# Altium project PCB_Project.PrjPcb (part 2 of 2)

## Sheet audio_in_dsp_radio.SchDoc
size A3
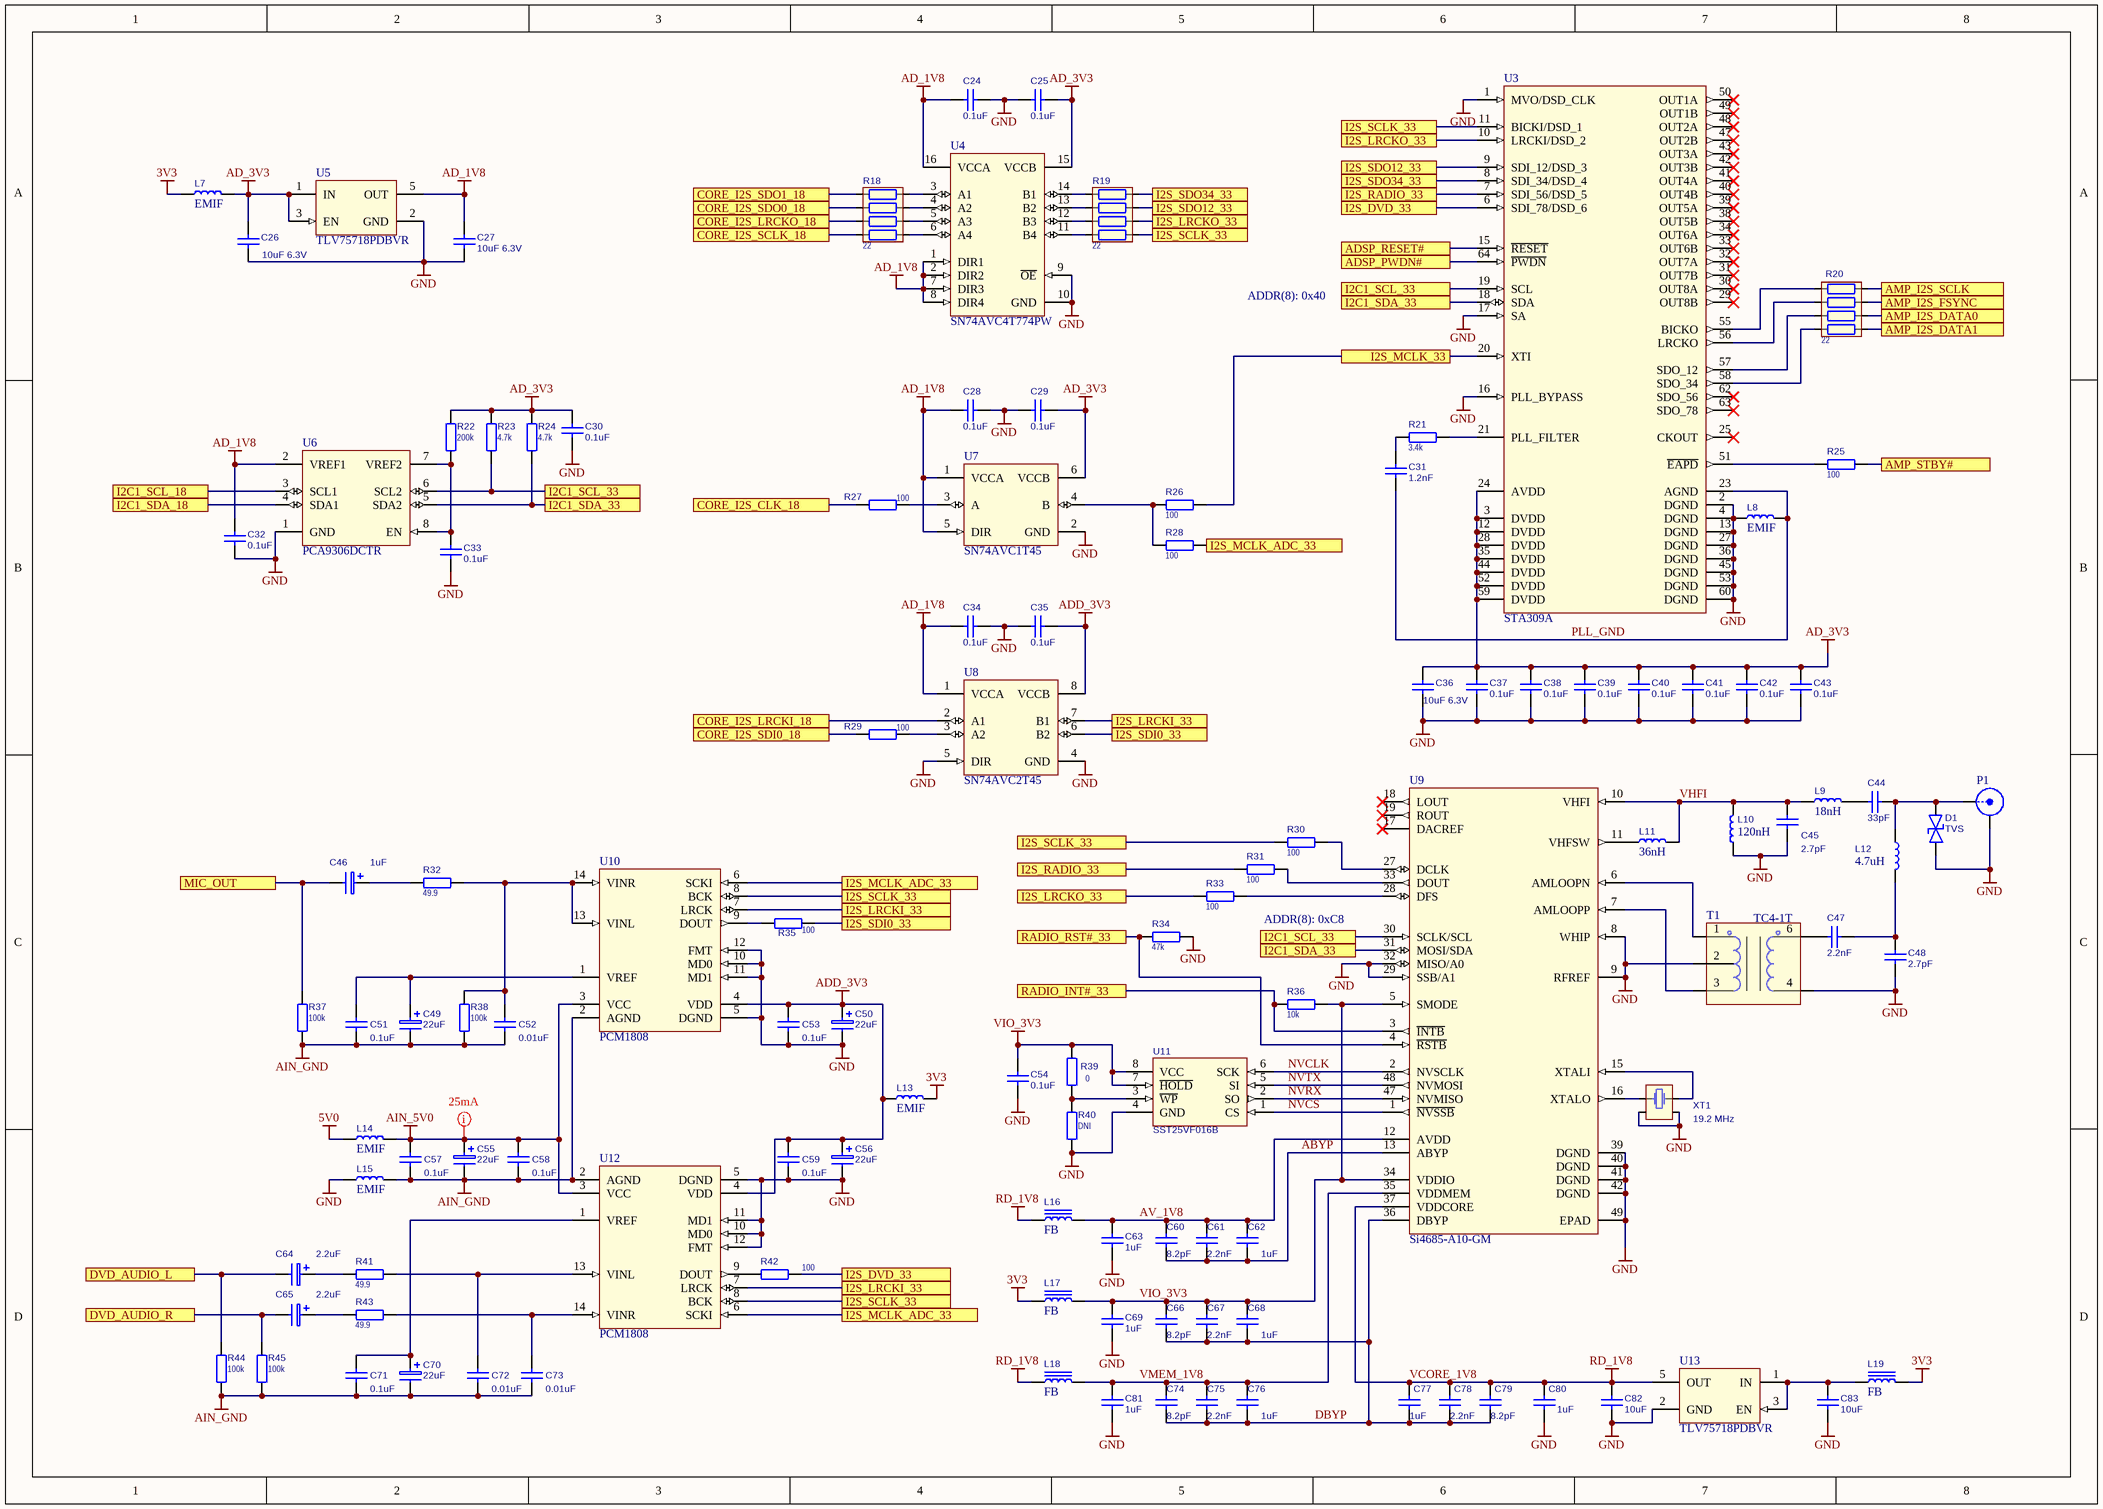
[diagram p5: audio_in_dsp_radio.SchDoc]

### Parts
C24  value 0.1uF  [C0603]  (hidden comment: C1608X7R1H104K080AA)
C25  value 0.1uF  [C0603]  (hidden comment: C1608X7R1H104K080AA)
C26  value 10uF 6.3V  [C0603]  (hidden comment: CC0603MRX5R5BB106)
C27  value 10uF 6.3V  [C0603]  (hidden comment: CC0603MRX5R5BB106)
C28  value 0.1uF  [C0603]  (hidden comment: C1608X7R1H104K080AA)
C29  value 0.1uF  [C0603]  (hidden comment: C1608X7R1H104K080AA)
C30  value 0.1uF  [C0603]  (hidden comment: C1608X7R1H104K080AA)
C31  value 1.2nF  [C0603]  (hidden comment: GRM1885C1H122JA01D)
C32  value 0.1uF  [C0603]  (hidden comment: C1608X7R1H104K080AA)
C33  value 0.1uF  [C0603]  (hidden comment: C1608X7R1H104K080AA)
C34  value 0.1uF  [C0603]  (hidden comment: C1608X7R1H104K080AA)
C35  value 0.1uF  [C0603]  (hidden comment: C1608X7R1H104K080AA)
C36  value 10uF 6.3V  [C0603]  (hidden comment: CC0603MRX5R5BB106)
C37  value 0.1uF  [C0603]  (hidden comment: C1608X7R1H104K080AA)
C38  value 0.1uF  [C0603]  (hidden comment: C1608X7R1H104K080AA)
C39  value 0.1uF  [C0603]  (hidden comment: C1608X7R1H104K080AA)
C40  value 0.1uF  [C0603]  (hidden comment: C1608X7R1H104K080AA)
C41  value 0.1uF  [C0603]  (hidden comment: C1608X7R1H104K080AA)
C42  value 0.1uF  [C0603]  (hidden comment: C1608X7R1H104K080AA)
C43  value 0.1uF  [C0603]  (hidden comment: C1608X7R1H104K080AA)
C44  value 33pF  [C0603]  (hidden comment: 06035A330JAT2A)
C45  value 2.7pF  [C0603]  (hidden comment: GCM1885C2A2R7BA16D)
C46  value 1uF  [TANTAL-A-1206]  (hidden comment: 293D105X9035A2TE3)
C47  value 2.2nF  [C0603]  (hidden comment: CL10B222KB8NNNC)
C48  value 2.7pF  [C0603]  (hidden comment: GCM1885C2A2R7BA16D)
C49  value 22uF  [TANTAL-A-1206]  (hidden comment: 293D226X9010A2TE3)
C50  value 22uF  [TANTAL-A-1206]  (hidden comment: 293D226X9010A2TE3)
C51  value 0.1uF  [C0603]  (hidden comment: CC0603KRX7R9BB104)
C52  value 0.01uF  [C0603]  (hidden comment: CL10B103KB8NNNC)
C53  value 0.1uF  [C0603]  (hidden comment: CC0603KRX7R9BB104)
C54  value 0.1uF  [C0603]  (hidden comment: CC0603KRX7R9BB104)
C55  value 22uF  [TANTAL-A-1206]  (hidden comment: 293D226X9010A2TE3)
C56  value 22uF  [TANTAL-A-1206]  (hidden comment: 293D226X9010A2TE3)
C57  value 0.1uF  [C0603]  (hidden comment: CC0603KRX7R9BB104)
C58  value 0.1uF  [C0603]  (hidden comment: CC0603KRX7R9BB104)
C59  value 0.1uF  [C0603]  (hidden comment: CC0603KRX7R9BB104)
C60  value 8.2pF  [C0603]  (hidden comment: CC0603CRNPO9BN8R2)
C61  value 2.2nF  [C0603]  (hidden comment: CL10B222KB8NNNC)
C62  value 1uF  [C0603]  (hidden comment: GRM188R61E105KA12D)
C63  value 1uF  [C0603]  (hidden comment: CC0603KRX7R9BB105)
C64  value 2.2uF  [TANTAL-A-1206]  (hidden comment: 293D225X9010A2TE3)
C65  value 2.2uF  [TANTAL-A-1206]  (hidden comment: 293D225X9010A2TE3)
C66  value 8.2pF  [C0603]  (hidden comment: CC0603CRNPO9BN8R2)
C67  value 2.2nF  [C0603]  (hidden comment: CL10B222KB8NNNC)
C68  value 1uF  [C0603]  (hidden comment: GRM188R61E105KA12D)
C69  value 1uF  [C0603]  (hidden comment: CC0603KRX7R9BB105)
C70  value 22uF  [TANTAL-A-1206]  (hidden comment: 293D226X9010A2TE3)
C71  value 0.1uF  [C0603]  (hidden comment: CC0603KRX7R9BB104)
C72  value 0.01uF  [C0603]  (hidden comment: CL10B103KB8NNNC)
C73  value 0.01uF  [C0603]  (hidden comment: CL10B103KB8NNNC)
C74  value 8.2pF  [C0603]  (hidden comment: CC0603CRNPO9BN8R2)
C75  value 2.2nF  [C0603]  (hidden comment: CL10B222KB8NNNC)
C76  value 1uF  [C0603]  (hidden comment: GRM188R61E105KA12D)
C77  value 1uF  [C0603]  (hidden comment: CC0603KRX7R9BB105)
C78  value 2.2nF  [C0603]  (hidden comment: CL10B222KB8NNNC)
C79  value 8.2pF  [C0603]  (hidden comment: CC0603CRNPO9BN8R2)
C80  value 1uF  [C0603]  (hidden comment: GRM188R61E105KA12D)
C81  value 1uF  [C0603]  (hidden comment: CC0603KRX7R9BB105)
C82  value 10uF  [C0603]  (hidden comment: CC0603MRX5R5BB106)
C83  value 10uF  [C0603]  (hidden comment: CC0603MRX5R5BB106)
D1  value TVS  [SOD-323]  (hidden comment: CDSOD323-T05LC)
L7  value EMIF  [IND0805]  (hidden comment: BLM21PG221SN1D)
L8  value EMIF  [IND0603]  (hidden comment: BLM18AG102SN1D)
L9  value 18nH  [IND0603]  (hidden comment: LQW18AN18NJ0ZD)
L10  value 120nH  [IND0603]  (hidden comment: LQW18ANR12J00D)
L11  value 36nH  [IND0603]  (hidden comment: LQW18AN36NG00D)
L12  value 4.7uH  [IND0603]  (hidden comment: CIL 10J 4R7)
L13  value EMIF  [IND0603]  (hidden comment: BLM18AG102SN1D)
L14  value EMIF  [IND0603]  (hidden comment: BLM18AG102SN1D)
L15  value EMIF  [IND0603]  (hidden comment: BLM18AG102SN1D)
L16  value FB  [IND0603]  (hidden comment: BLM18AG102SN1D)
L17  value FB  [IND0603]  (hidden comment: BLM18AG102SN1D)
L18  value FB  [IND0603]  (hidden comment: BLM18AG102SN1D)
L19  value FB  [IND0603]  (hidden comment: BLM18AG102SN1D)
P1  I-PEX  [SMA-RIGHT]  (value not drawn)
R18  value 22  [R0804X4]  (hidden comment: TC124-JR-0722RL)
R19  value 22  [R0804X4]  (hidden comment: TC124-JR-0722RL)
R20  value 22  [R0804X4]  (hidden comment: TC124-JR-0722RL)
R21  3.4k  [R0603]
R22  200k  [R0603]
R23  4.7k  [R0603]
R24  4.7k  [R0603]
R25  100  [R0603]
R26  100  [R0603]
R27  100  [R0603]
R28  100  [R0603]
R29  100  [R0603]
R30  100  [R0603]
R31  100  [R0603]
R32  49.9  [R0603]
R33  100  [R0603]
R34  47k  [R0603]
R35  100  [R0603]
R36  10k  [R0603]
R37  100k  [R0603]
R38  100k  [R0603]
R39  0  [R0603]
R40  DNI  [R0603]
R41  49.9  [R0603]
R42  100  [R0603]
R43  49.9  [R0603]
R44  100k  [R0603]
R45  100k  [R0603]
T1  TC4-1T  [AT224]
U3  STA309A  [LQFP64_N]
U4  SN74AVC4T774PW  [TSSOP-16]
U5  TLV75718PDBVR  [SOT-23-5]
U6  PCA9306DCTR  [SSOP-8]
U7  SN74AVC1T45  [SOT-23-6]
U8  SN74AVC2T45  [SSOP-8]
U9  value Si4685-A10-GM  [QFN-48-7X7]  (hidden comment: Si473x-GM)
U10  PCM1808  [TSSOP-14]
U11  SST25VF016B  [SOIC8WA]
U12  PCM1808  [TSSOP-14]
U13  TLV75718PDBVR  [SOT-23-5]
XT1  value 19.2 MHz  [NX3225]  (hidden comment: NX3225GA-19.2M)

### Ports
ADSP_PWDN#, ADSP_RESET#, AMP_I2S_DATA0, AMP_I2S_DATA1, AMP_I2S_FSYNC, AMP_I2S_SCLK, AMP_STBY#, CORE_I2S_CLK_18, CORE_I2S_LRCKI_18, CORE_I2S_LRCKO_18, CORE_I2S_SCLK_18, CORE_I2S_SDI0_18, CORE_I2S_SDO0_18, CORE_I2S_SDO1_18, DVD_AUDIO_L, DVD_AUDIO_R, I2C1_SCL_18, I2C1_SCL_33, I2C1_SDA_18, I2C1_SDA_33, I2S_DVD_33, I2S_LRCKI_33, I2S_LRCKO_33, I2S_MCLK_33, I2S_MCLK_ADC_33, I2S_RADIO_33, I2S_SCLK_33, I2S_SDI0_33, I2S_SDO12_33, I2S_SDO34_33, MIC_OUT, RADIO_INT#_33, RADIO_RST#_33

### Nets
3V3: L7.2 L13.1 L17.2 L19.1
5V0: L14.2
AD_1V8: C24.2 C27.1 C28.2 C32.2 C34.2 U4.1(DIR1) U4.2(DIR2) U4.7(DIR3) U4.8(DIR4) U4.16(VCCA) U5.5(OUT) U6.2(VREF1) U7.1(VCCA) U7.5(DIR) U8.1(VCCA)
AD_3V3: C25.1 C26.1 C29.1 C30.2 C36.1 C37.2 C38.2 C39.2 C40.2 C41.2 C42.2 C43.2 L7.1 R22.1 R23.1 R24.1 U3.3(DVDD) U3.12(DVDD) U3.24(AVDD) U3.28(DVDD) U3.35(DVDD) U3.44(DVDD) U3.52(DVDD) U3.59(DVDD) U4.15(VCCB) U5.1(IN) U5.3(EN) U7.6(VCCB)
ADD_3V3: C35.1 C50.1(+) C53.1 C56.1(+) C59.1 L13.2 U8.8(VCCB) U10.4(VDD) U12.4(VDD)
AIN_5V0: C55.1(+) C57.1 C58.1 L14.1 U10.3(VCC) U12.3(VCC)
AIN_GND: C49.2(-) C51.2 C52.2 C55.2(-) C57.2 C58.2 C70.2(-) C71.2 C72.2 C73.2 L15.1 R37.2 R38.2 R44.2 R45.2 U10.2(AGND) U12.2(AGND)
GND: C24.1 C25.2 C26.2 C27.2 C28.1 C29.2 C30.1 C32.1 C33.1 C34.1 C35.2 C36.2 C37.1 C38.1 C39.1 C40.1 C41.1 C42.1 C43.1 C45.1 C48.1 C50.2(-) C53.2 C54.2 C56.2(-) C59.2 C63.2 C69.2 C80.2 C81.2 C82.2 C83.2 D1.1 L8.2 L10.2 L15.2 P1.2(Y) R34.2 R40.1 T1.2 T1.4 U3.1(MVO/DSD_CLK) U3.2(DGND) U3.4(DGND) U3.13(DGND) U3.16(PLL_BYPASS) U3.17(SA) U3.27(DGND) U3.36(DGND) U3.45(DGND) U3.53(DGND) U3.60(DGND) U4.9(~{OE}) U4.10(GND) U5.2(GND) U6.1(GND) U7.2(GND) U8.4(GND) U8.5(DIR) U9.8(WHIP) U9.9(RFREF) U9.29(SSB/A1) U9.32(MISO/A0) U9.39(DGND) U9.40(DGND) U9.41(DGND) U9.42(DGND) U9.49(EPAD) U10.5(DGND) U10.10(MD0) U10.11(MD1) U10.12(FMT) U11.4(GND) U12.5(DGND) U12.10(MD0) U12.11(MD1) U12.12(FMT) U13.2(GND) XT1.2(GND) XT1.4(GND)
VCORE_1V8: C77.1 C78.1 C79.1 C80.1 C82.1 L16.2 L18.2 U9.37(VDDCORE) U13.5(OUT)  [also labelled RD_1V8]
VIO_3V3: C54.1 C66.1 C67.1 C68.1 C69.1 L17.1 R36.2 R39.2 U9.5(SMODE) U9.34(VDDIO) U11.7(~{HOLD}) U11.8(VCC)
ABYP: C60.2 C61.2 C62.2 U9.13(ABYP)
ADSP_PWDN#: U3.64(~{PWDN}) ; port ADSP_PWDN#
ADSP_RESET#: U3.15(~{RESET}) ; port ADSP_RESET#
AMP_I2S_DATA0: R20.5 ; port AMP_I2S_DATA0
AMP_I2S_DATA1: R20.7 ; port AMP_I2S_DATA1
AMP_I2S_FSYNC: R20.3 ; port AMP_I2S_FSYNC
AMP_I2S_SCLK: R20.1 ; port AMP_I2S_SCLK
AMP_STBY#: R25.2 ; port AMP_STBY#
AV_1V8: C60.1 C61.1 C62.1 C63.1 L16.1 U9.12(AVDD)
CORE_I2S_CLK_18: R27.1 ; port CORE_I2S_CLK_18
CORE_I2S_LRCKI_18: U8.2(A1) ; port CORE_I2S_LRCKI_18
CORE_I2S_LRCKO_18: R18.4 ; port CORE_I2S_LRCKO_18
CORE_I2S_SCLK_18: R18.2 ; port CORE_I2S_SCLK_18
CORE_I2S_SDI0_18: R29.1 ; port CORE_I2S_SDI0_18
CORE_I2S_SDO0_18: R18.6 ; port CORE_I2S_SDO0_18
CORE_I2S_SDO1_18: R18.8 ; port CORE_I2S_SDO1_18
DBYP: C66.2 C67.2 C68.2 C74.2 C75.2 C76.2 C77.2 C78.2 C79.2 U9.36(DBYP)
DVD_AUDIO_L: C64.2(-) R44.1 ; port DVD_AUDIO_L
DVD_AUDIO_R: C65.2(-) R45.1 ; port DVD_AUDIO_R
I2C1_SCL_18: U6.3(SCL1) ; port I2C1_SCL_18
I2C1_SCL_33: R23.2 U3.19(SCL) U6.6(SCL2) U9.30(SCLK/SCL) ; port I2C1_SCL_33
I2C1_SDA_18: U6.4(SDA1) ; port I2C1_SDA_18
I2C1_SDA_33: R24.2 U3.18(SDA) U6.5(SDA2) U9.31(MOSI/SDA) ; port I2C1_SDA_33
I2S_DVD_33: R42.2 U3.6(SDI_78/DSD_6) ; port I2S_DVD_33
I2S_LRCKI_33: U8.7(B1) U10.7(LRCK) U12.7(LRCK) ; port I2S_LRCKI_33
I2S_LRCKO_33: R19.3 R33.1 U3.10(LRCKI/DSD_2) ; port I2S_LRCKO_33
I2S_MCLK_33: R26.2 U3.20(XTI) ; port I2S_MCLK_33
I2S_MCLK_ADC_33: R28.2 U10.6(SCKI) U12.6(SCKI) ; port I2S_MCLK_ADC_33
I2S_RADIO_33: R31.1 U3.7(SDI_56/DSD_5) ; port I2S_RADIO_33
I2S_SCLK_33: R19.1 R30.1 U3.11(BICKI/DSD_1) U10.8(BCK) U12.8(BCK) ; port I2S_SCLK_33
I2S_SDI0_33: R35.2 U8.6(B2) ; port I2S_SDI0_33
I2S_SDO12_33: R19.5 U3.9(SDI_12/DSD_3) ; port I2S_SDO12_33
I2S_SDO34_33: R19.7 U3.8(SDI_34/DSD_4) ; port I2S_SDO34_33
MIC_OUT: C46.2(-) R37.1 ; port MIC_OUT
NVCLK: U9.2(NVSCLK) U11.6(SCK)
NVCS: U9.1(~{NVSSB}) U11.1(CS)
NVRX: U9.47(NVMISO) U11.2(SO)
NVTX: U9.48(NVMOSI) U11.5(SI)
PLL_GND: C31.2 L8.1 U3.23(AGND)
RADIO_INT#_33: R36.1 U9.3(~{INTB}) ; port RADIO_INT#_33
RADIO_RST#_33: R34.1 U9.4(~{RSTB}) ; port RADIO_RST#_33
VHFI: C45.2 L9.2 L10.1 L11.1 U9.10(VHFI)
VMEM_1V8: C74.1 C75.1 C76.1 C81.1 L18.1 U9.35(VDDMEM)
NetC31_1: C31.1 R21.2
NetC33_2: C33.2 R22.2 U6.7(VREF2) U6.8(EN)
NetC44_1: C44.1 L9.1
NetC44_2: C44.2 D1.2 L12.2 P1.1(X)
NetC46_1: C46.1(+) R32.1
NetC47_1: C47.1 T1.6
NetC47_2: C47.2 C48.2 L12.1
NetC49_1: C49.1(+) C51.1 U10.1(VREF)
NetC52_1: C52.1 R32.2 R38.1 U10.13(VINL) U10.14(VINR)
NetC64_1: C64.1(+) R41.1
NetC65_1: C65.1(+) R43.1
NetC70_1: C70.1(+) C71.1 U12.1(VREF)
NetC72_1: C72.1 R41.2 U12.13(VINL)
NetC73_1: C73.1 R43.2 U12.14(VINR)
NetC83_1: C83.1 L19.2 U13.1(IN) U13.3(EN)
NetL11_2: L11.2 U9.11(VHFSW)
NetR18_1: R18.1 U4.6(A4)
NetR18_3: R18.3 U4.5(A3)
NetR18_5: R18.5 U4.4(A2)
NetR18_7: R18.7 U4.3(A1)
NetR19_2: R19.2 U4.11(B4)
NetR19_4: R19.4 U4.12(B3)
NetR19_6: R19.6 U4.13(B2)
NetR19_8: R19.8 U4.14(B1)
NetR20_2: R20.2 U3.55(BICKO)
NetR20_4: R20.4 U3.56(LRCKO)
NetR20_6: R20.6 U3.57(SDO_12)
NetR20_8: R20.8 U3.58(SDO_34)
NetR21_1: R21.1 U3.21(PLL_FILTER)
NetR25_1: R25.1 U3.51(~{EAPD})
NetR26_1: R26.1 R28.1 U7.4(B)
NetR27_2: R27.2 U7.3(A)
NetR29_2: R29.2 U8.3(A2)
NetR30_2: R30.2 U9.27(DCLK)
NetR31_2: R31.2 U9.33(DOUT)
NetR33_2: R33.2 U9.28(DFS)
NetR35_1: R35.1 U10.9(DOUT)
NetR39_1: R39.1 R40.2 U11.3(~{WP})
NetR42_1: R42.1 U12.9(DOUT)
NetT1_1: T1.1 U9.6(AMLOOPN)
NetT1_3: T1.3 U9.7(AMLOOPP)
NetU9_15: U9.15(XTALI) XT1.1
NetU9_16: U9.16(XTALO) XT1.3

Not connected (* = marked no-connect by the designer): U3 25(CKOUT)* 29(OUT8B)* 30(OUT8A)* 31(OUT7B)* 32(OUT7A)* 33(OUT6B)* 34(OUT6A)* 38(OUT5B)* 39(OUT5A)* 40(OUT4B)* 41(OUT4A)* 42(OUT3B)* 43(OUT3A)* 47(OUT2B)* 48(OUT2A)* 49(OUT1B)* 50(OUT1A)* 62(SDO_56)* 63(SDO_78)*; U9 17(DACREF)* 18(LOUT)* 19(ROUT)*

### Layout directives
mark named 25mA: AIN_5V0

### Notes on the sheet
- ADDR(8): 0x40
- ADDR(8): 0xC8

### Library data of the parts
C24-C45 C47 C48 C51-C54 C57-C63 C66-C69 C71-C83 = CAP_NPOL
C46 C49 C50 C55 C56 C64 C65 C70 = CAP_POL
D1 = TVS_BIDIR: TVS Diodes
L7-L15 = IND_WO_IRON
L16-L19 = IND_W_IRON
P1 = BNC: LatestRevisionDate: 17-Jul-2002; LatestRevisionNote: Re-released for DXP Platform.; Publisher: Altium Limited
R18-R20 = ARRAY
R21-R45 = RESISTOR: RES
  R21: Value: 3.4k
  R22: Value: 200k
  R23 R24: Value: 4.7k
  R25-R31 R33 R35 R42: Value: 100
  R32 R41 R43: Value: 49.9
  R34: Value: 47k
  R36: Value: 10k
  R37 R38 R44 R45: Value: 100k
  R39: Value: 0
  R40: Value: DNI
T1 = TC4-1T: RF WIDEBAND; value: TC4-1T
U3 = STA309A: Multi-channel digital audio processor with DDX®; Value: STA309A
U4 = SN74AVC4T774PW: 4-Bit Dual-Supply Bus Transceiver With Configurable Voltage-Level Shifting and 3-State Outputs; value: SN74AVC4T774
U5 = TLV733P: Capacitor-Free, 300-mA, Low-Dropout Regulator with Foldback Current Limit for Portable Devices; value: TLV733P
U6 = PCA9306: PCA9306 Dual Bidirectional I2C Bus and SMBus Voltage-Level Translator; value: PCA9306DCTR
U7 = SN74AVC1T45: SN74AVC4T245 Dual-Bit Bus Transceiver with Configurable Voltage Translation and 3-State Outputs; value: SN74AVC1T45
U8 = SN74AVC2T45: SN74AVC4T245 Dual-Bit Bus Transceiver with Configurable Voltage Translation and 3-State Outputs; value: SN74AVC2T45
U9 = Si468x-GM: BROADCAST AM/AMHD-FM/FMHD-DAB/DAB+ RADIO RECEIVER
U10 U12 = PCM1808: PCM1808 Single-Ended, Analog-Input 24-Bit, 96-kHz Stereo ADC; value: PCM1808
U11 = AT25DF161: AT25DF161-SH-T; Value: SST25VF016B
U13 = TLV733P: Capacitor-Free, 1A, Low-Dropout Regulator with Foldback Current Limit for Portable Devices; value: TLV75718PDBVR
XT1 = XTAL4: Crystal rezonator 4 pins

## Sheet power_amp.SchDoc
size A4
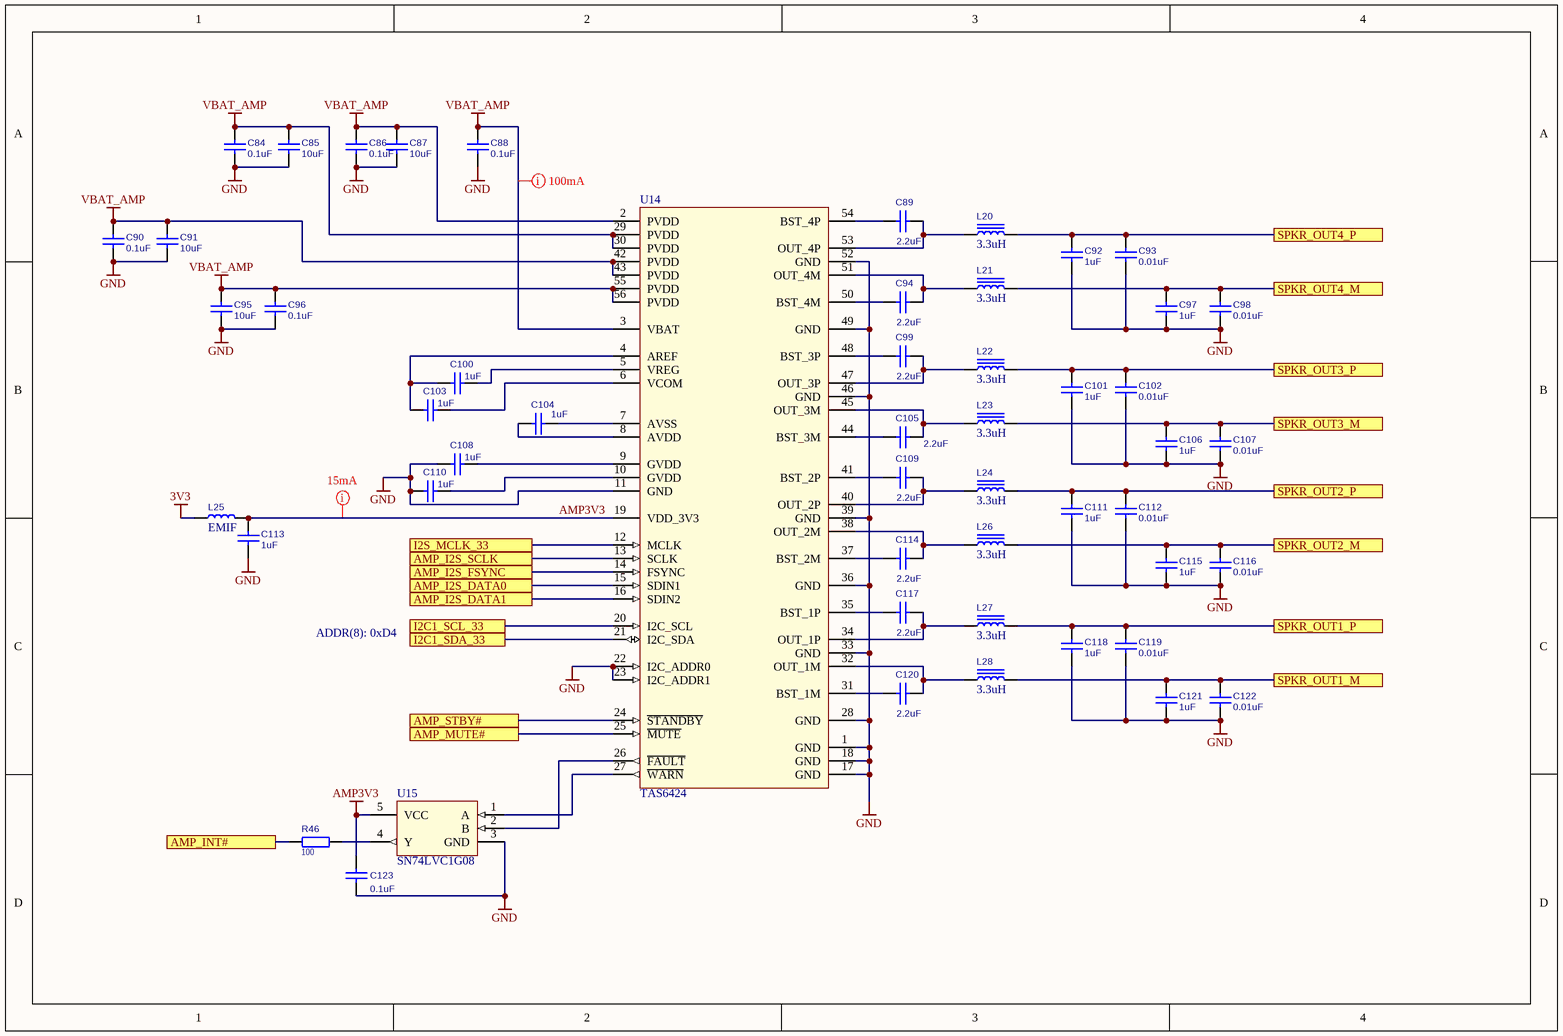
[diagram p6: power_amp.SchDoc]

### Parts
C84  value 0.1uF  [C0603]  (hidden comment: C1608X7R1H104K080AA)
C85  value 10uF  [C0805]  (hidden comment: GRM21BR61E106KA73L)
C86  value 0.1uF  [C0603]  (hidden comment: C1608X7R1H104K080AA)
C87  value 10uF  [C0805]  (hidden comment: GRM21BR61E106KA73L)
C88  value 0.1uF  [C0603]  (hidden comment: C1608X7R1H104K080AA)
C89  value 2.2uF  [C0603]  (hidden comment: GRM188R61H225KE11D)
C90  value 0.1uF  [C0603]  (hidden comment: C1608X7R1H104K080AA)
C91  value 10uF  [C0805]  (hidden comment: GRM21BR61E106KA73L)
C92  value 1uF  [C0603]  (hidden comment: CC0603KRX7R9BB105)
C93  value 0.01uF  [C0603]  (hidden comment: CL10B103KB8NNNC)
C94  value 2.2uF  [C0603]  (hidden comment: GRM188R61H225KE11D)
C95  value 10uF  [C0805]  (hidden comment: GRM21BR61E106KA73L)
C96  value 0.1uF  [C0603]  (hidden comment: C1608X7R1H104K080AA)
C97  value 1uF  [C0603]  (hidden comment: CC0603KRX7R9BB105)
C98  value 0.01uF  [C0603]  (hidden comment: CL10B103KB8NNNC)
C99  value 2.2uF  [C0603]  (hidden comment: GRM188R61H225KE11D)
C100  value 1uF  [C0603]  (hidden comment: CC0603KRX7R9BB105)
C101  value 1uF  [C0603]  (hidden comment: CC0603KRX7R9BB105)
C102  value 0.01uF  [C0603]  (hidden comment: CL10B103KB8NNNC)
C103  value 1uF  [C0603]  (hidden comment: CC0603KRX7R9BB105)
C104  value 1uF  [C0603]  (hidden comment: CC0603KRX7R9BB105)
C105  value 2.2uF  [C0603]  (hidden comment: GRM188R61H225KE11D)
C106  value 1uF  [C0603]  (hidden comment: CC0603KRX7R9BB105)
C107  value 0.01uF  [C0603]  (hidden comment: CL10B103KB8NNNC)
C108  value 1uF  [C0603]  (hidden comment: CC0603KRX7R9BB105)
C109  value 2.2uF  [C0603]  (hidden comment: GRM188R61H225KE11D)
C110  value 1uF  [C0603]  (hidden comment: CC0603KRX7R9BB105)
C111  value 1uF  [C0603]  (hidden comment: CC0603KRX7R9BB105)
C112  value 0.01uF  [C0603]  (hidden comment: CL10B103KB8NNNC)
C113  value 1uF  [C0603]  (hidden comment: CC0603KRX7R9BB105)
C114  value 2.2uF  [C0603]  (hidden comment: GRM188R61H225KE11D)
C115  value 1uF  [C0603]  (hidden comment: CC0603KRX7R9BB105)
C116  value 0.01uF  [C0603]  (hidden comment: CL10B103KB8NNNC)
C117  value 2.2uF  [C0603]  (hidden comment: GRM188R61H225KE11D)
C118  value 1uF  [C0603]  (hidden comment: CC0603KRX7R9BB105)
C119  value 0.01uF  [C0603]  (hidden comment: CL10B103KB8NNNC)
C120  value 2.2uF  [C0603]  (hidden comment: GRM188R61H225KE11D)
C121  value 1uF  [C0603]  (hidden comment: CC0603KRX7R9BB105)
C122  value 0.01uF  [C0603]  (hidden comment: CL10B103KB8NNNC)
C123  value 0.1uF  [C0603]  (hidden comment: CC0603KRX7R9BB104)
L20  value 3.3uH  [IHLP-2525CZ]  (hidden comment: IHLP2525CZER3R3M01)
L21  value 3.3uH  [IHLP-2525CZ]  (hidden comment: IHLP2525CZER3R3M01)
L22  value 3.3uH  [IHLP-2525CZ]  (hidden comment: IHLP2525CZER3R3M01)
L23  value 3.3uH  [IHLP-2525CZ]  (hidden comment: IHLP2525CZER3R3M01)
L24  value 3.3uH  [IHLP-2525CZ]  (hidden comment: IHLP2525CZER3R3M01)
L25  value EMIF  [IND0805]  (hidden comment: BLM21PG221SN1D)
L26  value 3.3uH  [IHLP-2525CZ]  (hidden comment: IHLP2525CZER3R3M01)
L27  value 3.3uH  [IHLP-2525CZ]  (hidden comment: IHLP2525CZER3R3M01)
L28  value 3.3uH  [IHLP-2525CZ]  (hidden comment: IHLP2525CZER3R3M01)
R46  100  [R0603]
U14  TAS6424  [HSSOP-56]
U15  value SN74LVC1G08  [SOT-23-5]  (hidden comment: SN74LVC1G08DBVR)

### Ports
AMP_I2S_DATA0, AMP_I2S_DATA1, AMP_I2S_FSYNC, AMP_I2S_SCLK, AMP_INT#, AMP_MUTE#, AMP_STBY#, I2C1_SCL_33, I2C1_SDA_33, I2S_MCLK_33, SPKR_OUT1_M, SPKR_OUT1_P, SPKR_OUT2_M, SPKR_OUT2_P, SPKR_OUT3_M, SPKR_OUT3_P, SPKR_OUT4_M, SPKR_OUT4_P

### Nets
3V3: L25.2
AMP3V3: C113.1 C123.1 L25.1 U14.19(VDD_3V3) U15.5(VCC)
GND: C84.2 C85.2 C86.2 C87.2 C88.2 C90.2 C91.2 C92.2 C93.2 C95.2 C96.2 C97.2 C98.2 C101.2 C102.2 C106.2 C107.2 C108.1 C110.1 C111.2 C112.2 C113.2 C115.2 C116.2 C118.2 C119.2 C121.2 C122.2 C123.2 U14.1(GND) U14.11(GND) U14.17(GND) U14.18(GND) U14.22(I2C_ADDR0) U14.23(I2C_ADDR1) U14.28(GND) U14.33(GND) U14.36(GND) U14.39(GND) U14.46(GND) U14.49(GND) U14.52(GND) U15.3(GND)
VBAT_AMP: C84.1 C85.1 C86.1 C87.1 C88.1 C90.1 C91.1 C95.1 C96.1 U14.2(PVDD) U14.3(VBAT) U14.29(PVDD) U14.30(PVDD) U14.42(PVDD) U14.43(PVDD) U14.55(PVDD) U14.56(PVDD)
AMP_I2S_DATA0: U14.15(SDIN1) ; port AMP_I2S_DATA0
AMP_I2S_DATA1: U14.16(SDIN2) ; port AMP_I2S_DATA1
AMP_I2S_FSYNC: U14.14(FSYNC) ; port AMP_I2S_FSYNC
AMP_I2S_SCLK: U14.13(SCLK) ; port AMP_I2S_SCLK
AMP_INT#: R46.1 ; port AMP_INT#
AMP_MUTE#: U14.25(~{MUTE}) ; port AMP_MUTE#
AMP_STBY#: U14.24(~{STANDBY}) ; port AMP_STBY#
I2C1_SCL_33: U14.20(I2C_SCL) ; port I2C1_SCL_33
I2C1_SDA_33: U14.21(I2C_SDA) ; port I2C1_SDA_33
I2S_MCLK_33: U14.12(MCLK) ; port I2S_MCLK_33
SPKR_OUT1_M: C121.1 C122.1 L28.2 ; port SPKR_OUT1_M
SPKR_OUT1_P: C118.1 C119.1 L27.2 ; port SPKR_OUT1_P
SPKR_OUT2_M: C115.1 C116.1 L26.2 ; port SPKR_OUT2_M
SPKR_OUT2_P: C111.1 C112.1 L24.2 ; port SPKR_OUT2_P
SPKR_OUT3_M: C106.1 C107.1 L23.2 ; port SPKR_OUT3_M
SPKR_OUT3_P: C101.1 C102.1 L22.2 ; port SPKR_OUT3_P
SPKR_OUT4_M: C97.1 C98.1 L21.2 ; port SPKR_OUT4_M
SPKR_OUT4_P: C92.1 C93.1 L20.2 ; port SPKR_OUT4_P
NetC89_1: C89.1 L20.1 U14.53(OUT_4P)
NetC89_2: C89.2 U14.54(BST_4P)
NetC94_1: C94.1 L21.1 U14.51(OUT_4M)
NetC94_2: C94.2 U14.50(BST_4M)
NetC99_1: C99.1 L22.1 U14.47(OUT_3P)
NetC99_2: C99.2 U14.48(BST_3P)
NetC100_1: C100.1 C103.1 U14.4(AREF)
NetC100_2: C100.2 U14.5(VREG)
NetC103_2: C103.2 U14.6(VCOM)
NetC104_1: C104.1 U14.8(AVDD)
NetC104_2: C104.2 U14.7(AVSS)
NetC105_1: C105.1 L23.1 U14.45(OUT_3M)
NetC105_2: C105.2 U14.44(BST_3M)
NetC108_2: C108.2 U14.9(GVDD)
NetC109_1: C109.1 L24.1 U14.40(OUT_2P)
NetC109_2: C109.2 U14.41(BST_2P)
NetC110_2: C110.2 U14.10(GVDD)
NetC114_1: C114.1 L26.1 U14.38(OUT_2M)
NetC114_2: C114.2 U14.37(BST_2M)
NetC117_1: C117.1 L27.1 U14.34(OUT_1P)
NetC117_2: C117.2 U14.35(BST_1P)
NetC120_1: C120.1 L28.1 U14.32(OUT_1M)
NetC120_2: C120.2 U14.31(BST_1M)
NetR46_2: R46.2 U15.4(Y)
NetU14_26: U14.26(~{FAULT}) U15.2(B)
NetU14_27: U14.27(~{WARN}) U15.1(A)

### Layout directives
mark named 15mA: AMP3V3
mark named 100mA: VBAT_AMP

### Notes on the sheet
- ADDR(8): 0xD4

### Library data of the parts
C84-C123 = CAP_NPOL
L20-L24 L26-L28 = IND_W_IRON
L25 = IND_WO_IRON
R46 = RESISTOR: RES; Value: 100
U14 = TAS6424: 75-W, 2-MHz Digital Input 4-Channel Automotive Class-D Audio Amplifier  With Load-Dump Protection and I  2C Diagnostics; value: TAS6424
U15 = SN74LVC1G08

## Sheet display_dvd_connectors.SchDoc
size A4
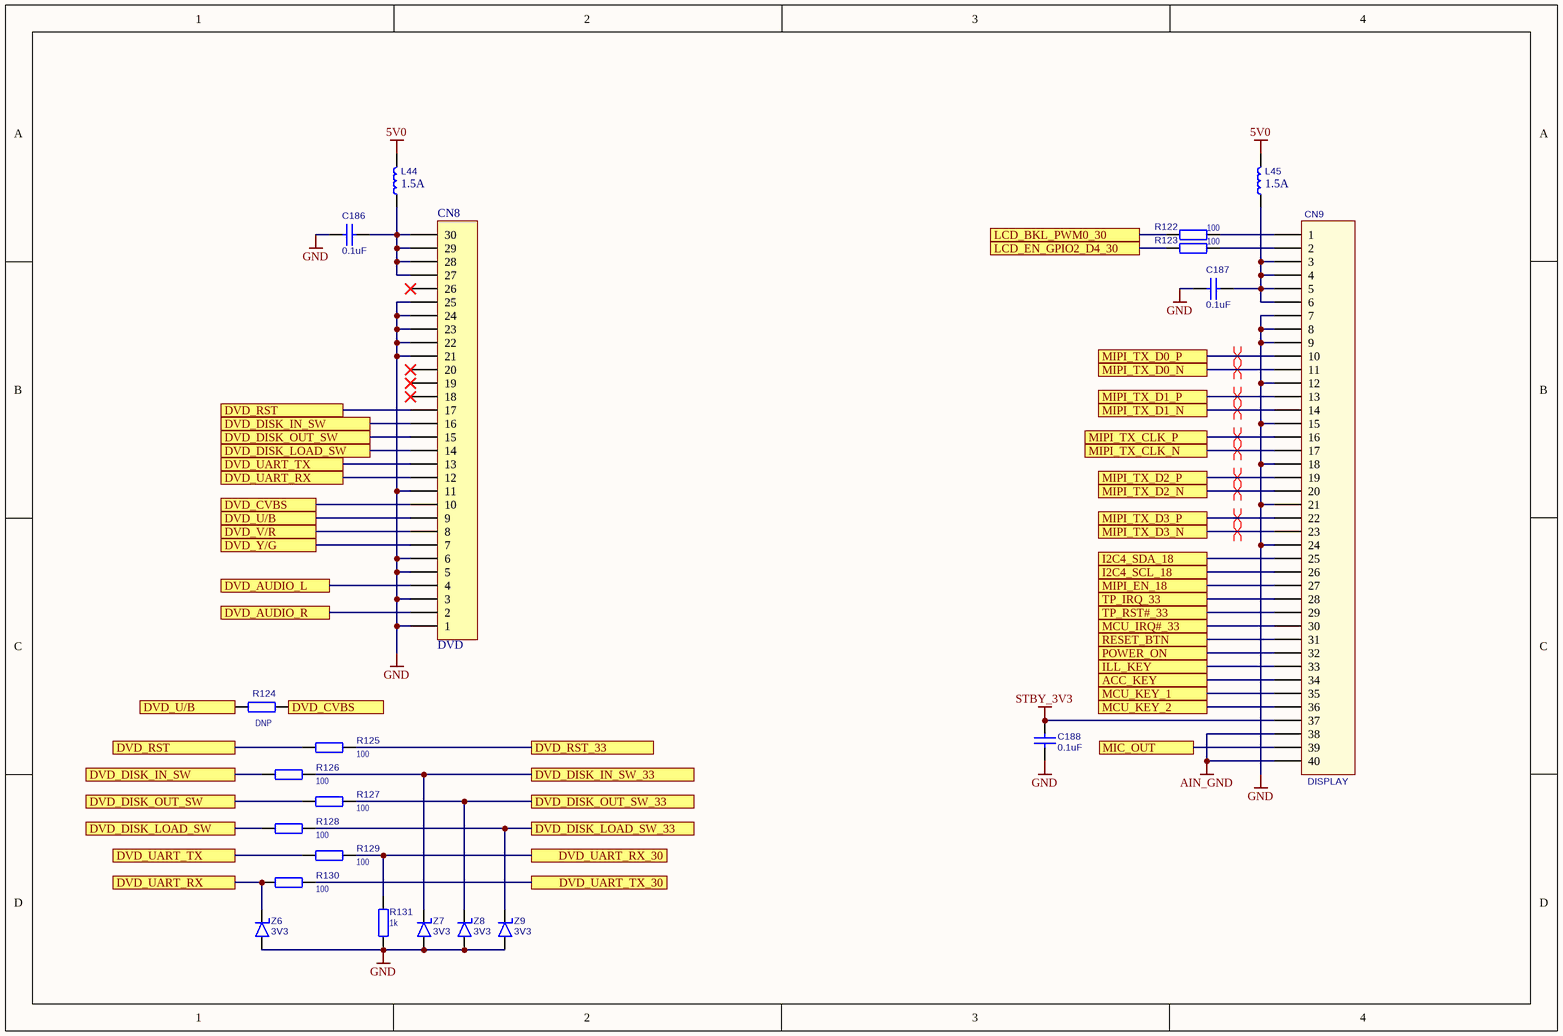
[diagram p7: display_dvd_connectors.SchDoc]

### Parts
C186  value 0.1uF  [C0603]  (hidden comment: C1608X7R1H104K080AA)
C187  value 0.1uF  [C0603]  (hidden comment: C1608X7R1H104K080AA)
C188  value 0.1uF  [C0603]  (hidden comment: C1608X7R1H104K080AA)
CN8  DVD  [30S-0.5SH]
CN9  DISPLAY  [40S-0.5SH]
L44  value 1.5A  [IND1206]  (hidden comment: BLM31PG601SN1L)
L45  value 1.5A  [IND1206]  (hidden comment: BLM31PG601SN1L)
R122  100  [R0603]
R123  100  [R0603]
R124  DNP  [R0603]
R125  100  [R0603]
R126  100  [R0603]
R127  100  [R0603]
R128  100  [R0603]
R129  100  [R0603]
R130  100  [R0603]
R131  1k  [R0603]
Z6  value 3V3  [SOD-323]  (hidden comment: BZX384-C3V3.115)
Z7  value 3V3  [SOD-323]  (hidden comment: BZX384-C3V3.115)
Z8  value 3V3  [SOD-323]  (hidden comment: BZX384-C3V3.115)
Z9  value 3V3  [SOD-323]  (hidden comment: BZX384-C3V3.115)

### Ports
ACC_KEY, DVD_AUDIO_L, DVD_AUDIO_R, DVD_CVBS, DVD_DISK_IN_SW, DVD_DISK_IN_SW_33, DVD_DISK_LOAD_SW, DVD_DISK_LOAD_SW_33, DVD_DISK_OUT_SW, DVD_DISK_OUT_SW_33, DVD_RST, DVD_RST_33, DVD_U/B, DVD_UART_RX, DVD_UART_RX_30, DVD_UART_TX, DVD_UART_TX_30, DVD_V/R, DVD_Y/G, I2C4_SCL_18, I2C4_SDA_18, ILL_KEY, LCD_BKL_PWM0_30, LCD_EN_GPIO2_D4_30, MCU_IRQ#_33, MCU_KEY_1, MCU_KEY_2, MIC_OUT, MIPI_EN_18, MIPI_TX_CLK_N, MIPI_TX_CLK_P, MIPI_TX_D0_N, MIPI_TX_D0_P, MIPI_TX_D1_N, MIPI_TX_D1_P, MIPI_TX_D2_N, MIPI_TX_D2_P, MIPI_TX_D3_N, MIPI_TX_D3_P, POWER_ON, RESET_BTN, TP_IRQ_33, TP_RST#_33

### Nets
5V0: L44.2 L45.2
AIN_GND: CN9.38 CN9.40
GND: C186.1 C187.1 C188.1 CN8.1 CN8.3 CN8.5 CN8.6 CN8.11 CN8.21 CN8.22 CN8.23 CN8.24 CN8.25 CN9.7 CN9.8 CN9.9 CN9.12 CN9.15 CN9.18 CN9.21 CN9.24 R131.2 Z6.1(A) Z7.1(A) Z8.1(A) Z9.1(A)
STBY_3V3: C188.2 CN9.37
ACC_KEY: CN9.34 ; port ACC_KEY
DVD_AUDIO_L: CN8.4 ; port DVD_AUDIO_L
DVD_AUDIO_R: CN8.2 ; port DVD_AUDIO_R
DVD_CVBS: CN8.10 R124.1 ; port DVD_CVBS
DVD_DISK_IN_SW: CN8.16 R126.2 ; port DVD_DISK_IN_SW
DVD_DISK_IN_SW_33: R126.1 Z7.2(K) ; port DVD_DISK_IN_SW_33
DVD_DISK_LOAD_SW: CN8.14 R128.2 ; port DVD_DISK_LOAD_SW
DVD_DISK_LOAD_SW_33: R128.1 Z9.2(K) ; port DVD_DISK_LOAD_SW_33
DVD_DISK_OUT_SW: CN8.15 R127.2 ; port DVD_DISK_OUT_SW
DVD_DISK_OUT_SW_33: R127.1 Z8.2(K) ; port DVD_DISK_OUT_SW_33
DVD_RST: CN8.17 R125.2 ; port DVD_RST
DVD_RST_33: R125.1 ; port DVD_RST_33
DVD_U/B: CN8.9 R124.2 ; port DVD_U/B
DVD_UART_RX: CN8.12 R130.2 Z6.2(K) ; port DVD_UART_RX
DVD_UART_RX_30: R129.1 R131.1 ; port DVD_UART_RX_30
DVD_UART_TX: CN8.13 R129.2 ; port DVD_UART_TX
DVD_UART_TX_30: R130.1 ; port DVD_UART_TX_30
DVD_V/R: CN8.8 ; port DVD_V/R
DVD_Y/G: CN8.7 ; port DVD_Y/G
I2C4_SCL_18: CN9.26 ; port I2C4_SCL_18
I2C4_SDA_18: CN9.25 ; port I2C4_SDA_18
ILL_KEY: CN9.33 ; port ILL_KEY
LCD_BKL_PWM0_30: R122.1 ; port LCD_BKL_PWM0_30
LCD_EN_GPIO2_D4_30: R123.1 ; port LCD_EN_GPIO2_D4_30
MCU_IRQ#_33: CN9.30 ; port MCU_IRQ#_33
MCU_KEY_1: CN9.35 ; port MCU_KEY_1
MCU_KEY_2: CN9.36 ; port MCU_KEY_2
MIC_OUT: CN9.39 ; port MIC_OUT
MIPI_EN_18: CN9.27 ; port MIPI_EN_18
MIPI_TX_CLK_N: CN9.17 ; port MIPI_TX_CLK_N
MIPI_TX_CLK_P: CN9.16 ; port MIPI_TX_CLK_P
MIPI_TX_D0_N: CN9.11 ; port MIPI_TX_D0_N
MIPI_TX_D0_P: CN9.10 ; port MIPI_TX_D0_P
MIPI_TX_D1_N: CN9.14 ; port MIPI_TX_D1_N
MIPI_TX_D1_P: CN9.13 ; port MIPI_TX_D1_P
MIPI_TX_D2_N: CN9.20 ; port MIPI_TX_D2_N
MIPI_TX_D2_P: CN9.19 ; port MIPI_TX_D2_P
MIPI_TX_D3_N: CN9.23 ; port MIPI_TX_D3_N
MIPI_TX_D3_P: CN9.22 ; port MIPI_TX_D3_P
POWER_ON: CN9.32 ; port POWER_ON
RESET_BTN: CN9.31 ; port RESET_BTN
TP_IRQ_33: CN9.28 ; port TP_IRQ_33
TP_RST#_33: CN9.29 ; port TP_RST#_33
NetC186_2: C186.2 CN8.27 CN8.28 CN8.29 CN8.30 L44.1
NetC187_2: C187.2 CN9.3 CN9.4 CN9.5 CN9.6 L45.1
NetCN9_1: CN9.1 R122.2
NetCN9_2: CN9.2 R123.2

Not connected (* = marked no-connect by the designer): CN8 18* 19* 20* 26*

### Layout directives
differential pair: MIPI_TX_CLK_N, MIPI_TX_CLK_P, MIPI_TX_D0_N, MIPI_TX_D0_P, MIPI_TX_D1_N, MIPI_TX_D1_P, MIPI_TX_D2_N, MIPI_TX_D2_P, MIPI_TX_D3_N, MIPI_TX_D3_P

### Library data of the parts
C186-C188 = CAP_NPOL
CN8 = HDR 30: Header, 30-Pin; LatestRevisionDate: 17-Jul-2002; LatestRevisionNote: Re-released for DXP Platform.; Publisher: Altium Limited
CN9 = FH12-40: DT38; Value: *
L44 L45 = IND_WO_IRON
R122-R131 = RESISTOR: RES
  R122 R123 R125-R130: Value: 100
  R124: Value: DNP
  R131: Value: 1k
Z6-Z9 = ZENNER_1: ZENNER

## Nets that join several sheets
1V8_S3: usb_main_connector (R59.2), core_module (M1.120 R75.2 R76.2 R77.1), video_in_gps_mems (R100.2)
3V3: power_supply (5 pins), usb_main_connector (L29.2), core_module (5 pins), wifi_bluetooth (L43.2), video_in_gps_mems (L34.1 L37.2 L38.1), audio_in_dsp_radio (L7.2 L13.1 L17.2 L19.1), power_amp (L25.2)
5V0: power_supply (7 pins), usb_main_connector (L31.1 L32.2), audio_in_dsp_radio (L14.2), display_dvd_connectors (L44.2 L45.2)
AIN_GND: audio_in_dsp_radio (17 pins), display_dvd_connectors (CN9.38 CN9.40)
GND: power_supply (37 pins), usb_main_connector (59 pins), core_module (18 pins), wifi_bluetooth (78 pins), video_in_gps_mems (46 pins), audio_in_dsp_radio (80 pins), power_amp (43 pins), display_dvd_connectors (26 pins)
STBY_3V3: power_supply (C7.1 C8.1 L3.2 R1.2), core_module (C148.2 D12.1 M1.42 R81.1), video_in_gps_mems (L35.2), display_dvd_connectors (C188.2 CN9.37)
VBAT: power_supply (5 pins), usb_main_connector (C124.2 R47.2 R52.2 VT2.2)
VBAT_AMP: power_supply (C2.1 L1.2), power_amp (17 pins)
ACC_KEY: usb_main_connector (VT5.3), display_dvd_connectors (CN9.34)
ADSP_PWDN#: core_module (M1.197 R84.1), audio_in_dsp_radio (U3.64)
ADSP_RESET#: core_module (M1.196 R83.1), audio_in_dsp_radio (U3.15)
ADV_IRQ#_18: core_module (M1.154), video_in_gps_mems (R100.1 U22.5)
ADV_PWRDN#_18: core_module (M1.153), video_in_gps_mems (R106.2 R107.1 U22.32)
AMP_I2S_DATA0: audio_in_dsp_radio (R20.5), power_amp (U14.15)
AMP_I2S_DATA1: audio_in_dsp_radio (R20.7), power_amp (U14.16)
AMP_I2S_FSYNC: audio_in_dsp_radio (R20.3), power_amp (U14.14)
AMP_I2S_SCLK: audio_in_dsp_radio (R20.1), power_amp (U14.13)
AMP_INT#: core_module (M1.192), power_amp (R46.1)
AMP_MUTE#: core_module (M1.195), power_amp (U14.25)
AMP_STBY#: audio_in_dsp_radio (R25.2), power_amp (U14.24)
ANT_PWR_EN: usb_main_connector (R57.2), core_module (M1.183)
BAT+: power_supply (C9.2 Q1.3), usb_main_connector (CN4.9)
BT_I2S_BCLK_18: core_module (M1.1), wifi_bluetooth (R112.7)
BT_I2S_FS_18: core_module (M1.4 R88.2), wifi_bluetooth (R112.1)
BT_I2S_SDI_18: core_module (M1.3), wifi_bluetooth (R112.3)
BT_I2S_SDO_18: core_module (M1.2), wifi_bluetooth (R112.5)
BT_REG_EN_30: core_module (M1.17), wifi_bluetooth (R113.1)
BT_UART_CTS#_18: core_module (M1.27), wifi_bluetooth (R111.3)
BT_UART_RTS#_18: core_module (M1.25), wifi_bluetooth (R111.7)
BT_UART_RX_18: core_module (M1.28), wifi_bluetooth (R111.1)
BT_UART_TX_18: core_module (M1.26), wifi_bluetooth (R111.5)
CORE_I2S_CLK_18: core_module (M1.8), audio_in_dsp_radio (R27.1)
CORE_I2S_LRCKI_18: core_module (M1.10), audio_in_dsp_radio (U8.2)
CORE_I2S_LRCKO_18: core_module (M1.11), audio_in_dsp_radio (R18.4)
CORE_I2S_SCLK_18: core_module (M1.9), audio_in_dsp_radio (R18.2)
CORE_I2S_SDI0_18: core_module (M1.12), audio_in_dsp_radio (R29.1)
CORE_I2S_SDO0_18: core_module (M1.14), audio_in_dsp_radio (R18.6)
CORE_I2S_SDO1_18: core_module (M1.15), audio_in_dsp_radio (R18.8)
DVD_AUDIO_L: audio_in_dsp_radio (C64.2 R44.1), display_dvd_connectors (CN8.4)
DVD_AUDIO_R: audio_in_dsp_radio (C65.2 R45.1), display_dvd_connectors (CN8.2)
DVD_DISK_IN_SW_33: core_module (M1.186), display_dvd_connectors (R126.1 Z7.2)
DVD_DISK_LOAD_SW_33: core_module (M1.188), display_dvd_connectors (R128.1 Z9.2)
DVD_DISK_OUT_SW_33: core_module (M1.185), display_dvd_connectors (R127.1 Z8.2)
DVD_RST_33: core_module (M1.187), display_dvd_connectors (R125.1)
DVD_U/B: video_in_gps_mems (R93.2), display_dvd_connectors (CN8.9 R124.2)
DVD_UART_RX_30: core_module (M1.46), display_dvd_connectors (R129.1 R131.1)
DVD_UART_TX_30: core_module (M1.47), display_dvd_connectors (R130.1)
DVD_V/R: video_in_gps_mems (R95.2), display_dvd_connectors (CN8.8)
DVD_Y/G: video_in_gps_mems (R89.2), display_dvd_connectors (CN8.7)
GPS_RST#_33: core_module (M1.200), video_in_gps_mems (M2.9 R98.2)
GPS_RX_33: core_module (M1.198), video_in_gps_mems (R90.2)
GPS_TX_33: core_module (M1.199), video_in_gps_mems (R92.2)
I2C1_SCL_18: core_module (M1.7), audio_in_dsp_radio (U6.3)
I2C1_SCL_33: audio_in_dsp_radio (R23.2 U3.19 U6.6 U9.30), power_amp (U14.20)
I2C1_SDA_18: core_module (M1.6), audio_in_dsp_radio (U6.4)
I2C1_SDA_33: audio_in_dsp_radio (R24.2 U3.18 U6.5 U9.31), power_amp (U14.21)
I2C4_SCL_18: core_module (M1.150 R76.1), video_in_gps_mems (U22.31), display_dvd_connectors (CN9.26)
I2C4_SDA_18: core_module (M1.151 R77.2), video_in_gps_mems (U22.30), display_dvd_connectors (CN9.25)
I2S_MCLK_33: audio_in_dsp_radio (R26.2 U3.20), power_amp (U14.12)
ILL_KEY: usb_main_connector (VT4.3), display_dvd_connectors (CN9.33)
LCD_BKL_PWM0_30: core_module (M1.38), display_dvd_connectors (R122.1)
LCD_EN_GPIO2_D4_30: core_module (M1.39), display_dvd_connectors (R123.1)
MCU_IRQ#_33: core_module (M1.189), display_dvd_connectors (CN9.30)
MCU_KEY_1: usb_main_connector (C134.1 R67.2 Z3.2), display_dvd_connectors (CN9.35)
MCU_KEY_2: usb_main_connector (C136.1 R72.2 Z5.2), display_dvd_connectors (CN9.36)
MEMS_INT1_18: core_module (M1.159), video_in_gps_mems (R109.1)
MEMS_INT2_18: core_module (M1.158), video_in_gps_mems (R110.1)
MIC_OUT: audio_in_dsp_radio (C46.2 R37.1), display_dvd_connectors (CN9.39)
MIPI_EN_18: core_module (M1.126), display_dvd_connectors (CN9.27)
MIPI_RX_CLK_N: core_module (M1.68), video_in_gps_mems (U22.12)
MIPI_RX_CLK_P: core_module (M1.69), video_in_gps_mems (U22.11)
MIPI_RX_D0_N: core_module (M1.72), video_in_gps_mems (U22.10)
MIPI_RX_D0_P: core_module (M1.73), video_in_gps_mems (U22.9)
MIPI_TX_CLK_N: core_module (M1.78), display_dvd_connectors (CN9.17)
MIPI_TX_CLK_P: core_module (M1.79), display_dvd_connectors (CN9.16)
MIPI_TX_D0_N: core_module (M1.82), display_dvd_connectors (CN9.11)
MIPI_TX_D0_P: core_module (M1.83), display_dvd_connectors (CN9.10)
MIPI_TX_D1_N: core_module (M1.80), display_dvd_connectors (CN9.14)
MIPI_TX_D1_P: core_module (M1.81), display_dvd_connectors (CN9.13)
MIPI_TX_D2_N: core_module (M1.76), display_dvd_connectors (CN9.20)
MIPI_TX_D2_P: core_module (M1.77), display_dvd_connectors (CN9.19)
MIPI_TX_D3_N: core_module (M1.74), display_dvd_connectors (CN9.23)
MIPI_TX_D3_P: core_module (M1.75), display_dvd_connectors (CN9.22)
POWER_ON: core_module (R85.1), display_dvd_connectors (CN9.32)
RADIO_INT#_33: core_module (M1.194), audio_in_dsp_radio (R36.1 U9.3)
RADIO_RST#_33: core_module (M1.193), audio_in_dsp_radio (R34.1 U9.4)
REF_32KHZ_18: core_module (M1.35), wifi_bluetooth (R121.1)
RESET_BTN: core_module (R82.1), display_dvd_connectors (CN9.31)
REVERSE_KEY: usb_main_connector (R56.1 VT1.3), core_module (M1.184)
SD_DET#: usb_main_connector (CN2.1 D10.2 R59.1), core_module (M1.133)
SDMMC0_CLK: usb_main_connector (R66.2), core_module (M1.127)
SDMMC0_CMD: usb_main_connector (R60.2), core_module (M1.132)
SDMMC0_D0: usb_main_connector (R61.8), core_module (M1.131)
SDMMC0_D1: usb_main_connector (R61.6), core_module (M1.130)
SDMMC0_D2: usb_main_connector (R61.4), core_module (M1.129)
SDMMC0_D3: usb_main_connector (R61.2), core_module (M1.128)
SDMMC0_PWR_18: usb_main_connector (R53.1), core_module (M1.134)
SPI1_CLK_18: core_module (M1.163), video_in_gps_mems (R108.3)
SPI1_CS#0_18: core_module (M1.162), video_in_gps_mems (R108.5)
SPI1_RX_18: core_module (M1.164), video_in_gps_mems (R108.1)
SPI1_TX_18: core_module (M1.161), video_in_gps_mems (R108.7)
SPKR_OUT1_M: usb_main_connector (CN4.5), power_amp (C121.1 C122.1 L28.2)
SPKR_OUT1_P: usb_main_connector (CN4.6), power_amp (C118.1 C119.1 L27.2)
SPKR_OUT2_M: usb_main_connector (CN4.7), power_amp (C115.1 C116.1 L26.2)
SPKR_OUT2_P: usb_main_connector (CN4.8), power_amp (C111.1 C112.1 L24.2)
SPKR_OUT3_M: usb_main_connector (CN4.15), power_amp (C106.1 C107.1 L23.2)
SPKR_OUT3_P: usb_main_connector (CN4.16), power_amp (C101.1 C102.1 L22.2)
SPKR_OUT4_M: usb_main_connector (CN4.13), power_amp (C97.1 C98.1 L21.2)
SPKR_OUT4_P: usb_main_connector (CN4.14), power_amp (C92.1 C93.1 L20.2)
SYS_VCC_EN: power_supply (R17.1), core_module (M1.34)
TP_IRQ_33: core_module (M1.191 R80.2), display_dvd_connectors (CN9.28)
TP_RST#_33: core_module (M1.190), display_dvd_connectors (CN9.29)
TYPEC0_D_N: usb_main_connector (U17.6), core_module (M1.105)
TYPEC0_D_P: usb_main_connector (U17.4), core_module (M1.106)
TYPEC0_U2VBUSDET: usb_main_connector (C135.1 R68.2 R70.2 Z4.2), core_module (M1.111)
USB20_D_N: usb_main_connector (U18.6), core_module (M1.116)
USB20_D_P: usb_main_connector (U18.4), core_module (M1.117)
USB20_PWEN_30: usb_main_connector (R73.1 U19.4), core_module (M1.41)
USB21_D_N: usb_main_connector (U20.6), core_module (M1.118)
USB21_D_P: usb_main_connector (U20.4), core_module (M1.119)
USB21_PWEN_30: usb_main_connector (R74.1 U21.4), core_module (M1.40)
WLAN_IRQ_18: core_module (M1.181), wifi_bluetooth (M3.14 R120.2)
WLAN_REG_EN_30: core_module (M1.30), wifi_bluetooth (R114.1)
WLAN_SDIO_CLK_18: core_module (M1.24), wifi_bluetooth (R118.2)
WLAN_SDIO_CMD_18: core_module (M1.23), wifi_bluetooth (R117.2)
WLAN_SDIO_D0_18: core_module (M1.19), wifi_bluetooth (R119.2)
WLAN_SDIO_D1_18: core_module (M1.20), wifi_bluetooth (R119.4)
WLAN_SDIO_D2_18: core_module (M1.21), wifi_bluetooth (R119.6)
WLAN_SDIO_D3_18: core_module (M1.22), wifi_bluetooth (R119.8)